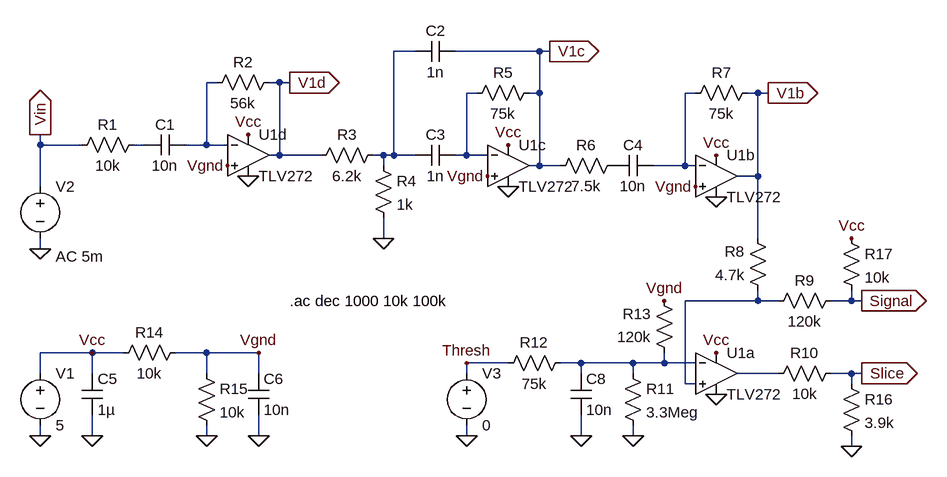
[diagram p0: schematic AnalogModel.asc]
AnalogModel.asc, the LTspice schematic file:
Version 4
SHEET 1 1284 680
WIRE 464 -208 432 -208
WIRE 656 -208 528 -208
WIRE 672 -208 656 -208
WIRE 160 -160 144 -160
WIRE 256 -160 240 -160
WIRE 272 -160 256 -160
WIRE 560 -144 544 -144
WIRE 656 -144 656 -208
WIRE 656 -144 640 -144
WIRE 896 -144 880 -144
WIRE 992 -144 976 -144
WIRE 1008 -144 992 -144
WIRE -112 -64 -112 -80
WIRE -48 -64 -112 -64
WIRE 48 -64 32 -64
WIRE 144 -64 144 -160
WIRE 144 -64 112 -64
WIRE 176 -64 144 -64
WIRE 256 -48 256 -160
WIRE 256 -48 240 -48
WIRE 320 -48 256 -48
WIRE 416 -48 400 -48
WIRE 432 -48 432 -208
WIRE 432 -48 416 -48
WIRE 464 -48 432 -48
WIRE 544 -48 544 -144
WIRE 544 -48 528 -48
WIRE 576 -48 544 -48
WIRE 416 -32 416 -48
WIRE 656 -32 656 -144
WIRE 656 -32 640 -32
WIRE 688 -32 656 -32
WIRE 880 -32 880 -144
WIRE 880 -32 832 -32
WIRE 896 -32 880 -32
WIRE 992 -16 992 -144
WIRE 992 -16 960 -16
WIRE -112 0 -112 -64
WIRE 416 80 416 48
WIRE 992 80 992 -16
WIRE -112 96 -112 80
WIRE 992 176 992 160
WIRE 992 176 880 176
WIRE 1024 176 992 176
WIRE 1136 176 1136 160
WIRE 1136 176 1104 176
WIRE 1152 176 1136 176
WIRE -32 256 -112 256
WIRE 16 256 -32 256
WIRE 144 256 96 256
WIRE 224 256 144 256
WIRE 608 272 544 272
WIRE 720 272 688 272
WIRE 800 272 720 272
WIRE 848 272 848 256
WIRE 848 272 800 272
WIRE 896 272 848 272
WIRE -112 288 -112 256
WIRE -32 288 -32 256
WIRE 144 288 144 256
WIRE 224 288 224 256
WIRE 544 288 544 272
WIRE 720 288 720 272
WIRE 800 288 800 272
WIRE 1024 288 960 288
WIRE 1136 288 1104 288
WIRE 1152 288 1136 288
WIRE 880 304 880 176
WIRE 896 304 880 304
WIRE 1136 304 1136 288
WIRE -112 384 -112 368
WIRE -32 384 -32 352
WIRE 144 384 144 368
WIRE 224 384 224 352
WIRE 544 384 544 368
WIRE 720 384 720 352
WIRE 800 384 800 368
WIRE 1136 400 1136 384
FLAG -112 384 0
FLAG -32 384 0
FLAG 144 384 0
FLAG 224 384 0
FLAG 544 384 0
FLAG 720 384 0
FLAG 800 384 0
FLAG 928 320 0
FLAG 928 16 0
FLAG 608 0 0
FLAG 208 -16 0
FLAG 1136 400 0
FLAG -112 96 0
FLAG -32 256 Vcc
FLAG 208 -80 Vcc
FLAG 608 -64 Vcc
FLAG 928 256 Vcc
FLAG 928 -48 Vcc
FLAG 1136 80 Vcc
FLAG 224 256 Vgnd
FLAG 176 -32 Vgnd
FLAG 576 -16 Vgnd
FLAG 896 0 Vgnd
FLAG 848 176 Vgnd
FLAG 544 272 Thresh
FLAG -112 -80 Vin
IOPIN -112 -80 Out
FLAG 272 -160 V1d
IOPIN 272 -160 Out
FLAG 672 -208 V1c
IOPIN 672 -208 Out
FLAG 1008 -144 V1b
IOPIN 1008 -144 Out
FLAG 1152 176 Signal
IOPIN 1152 176 Out
FLAG 1152 288 Slice
IOPIN 1152 288 Out
FLAG 416 80 0
SYMBOL voltage -112 272 R0
SYMATTR InstName V1
SYMATTR Value 5
SYMBOL voltage -112 -16 R0
WINDOW 123 24 124 Left 2
WINDOW 39 0 0 Left 0
SYMATTR InstName V2
SYMATTR Value ""
SYMATTR Value2 AC 5m
SYMBOL voltage 544 272 R0
SYMATTR InstName V3
SYMATTR Value 0
SYMBOL Misc\\TLV272 208 -48 R0
SYMATTR InstName U1d
SYMBOL Misc\\TLV272 608 -32 R0
SYMATTR InstName U1c
SYMBOL Misc\\TLV272 928 -16 R0
SYMATTR InstName U1b
SYMBOL Misc\\TLV272 928 288 R0
SYMATTR InstName U1a
SYMBOL res 48 -80 R90
WINDOW 0 0 56 VBottom 2
WINDOW 3 32 56 VTop 2
SYMATTR InstName R1
SYMATTR Value 10k
SYMBOL res 256 -176 R90
WINDOW 0 0 56 VBottom 2
WINDOW 3 32 56 VTop 2
SYMATTR InstName R2
SYMATTR Value 56k
SYMBOL res 416 -64 R90
WINDOW 0 0 56 VBottom 2
WINDOW 3 32 56 VTop 2
SYMATTR InstName R3
SYMATTR Value 6.2k
SYMBOL res 400 -48 R0
SYMATTR InstName R4
SYMATTR Value 1k
SYMBOL res 784 -48 R90
WINDOW 0 0 56 VBottom 2
WINDOW 3 32 56 VTop 2
SYMATTR InstName R6
SYMATTR Value 7.5k
SYMBOL res 992 -160 R90
WINDOW 0 0 56 VBottom 2
WINDOW 3 32 56 VTop 2
SYMATTR InstName R7
SYMATTR Value 75k
SYMBOL res 1008 176 R180
WINDOW 0 36 76 Left 2
WINDOW 3 36 40 Left 2
SYMATTR InstName R8
SYMATTR Value 4.7k
SYMBOL res 1008 192 R270
WINDOW 0 32 56 VTop 2
WINDOW 3 0 56 VBottom 2
SYMATTR InstName R9
SYMATTR Value 120k
SYMBOL res 1008 304 R270
WINDOW 0 32 56 VTop 2
WINDOW 3 0 56 VBottom 2
SYMATTR InstName R10
SYMATTR Value 10k
SYMBOL res 784 272 R0
SYMATTR InstName R11
SYMATTR Value 3.3Meg
SYMBOL res 704 256 R90
WINDOW 0 0 56 VBottom 2
WINDOW 3 32 56 VTop 2
SYMATTR InstName R12
SYMATTR Value 75k
SYMBOL res 864 272 R180
WINDOW 0 36 76 Left 2
WINDOW 3 36 40 Left 2
SYMATTR InstName R13
SYMATTR Value 120k
SYMBOL res 0 272 R270
WINDOW 0 32 56 VTop 2
WINDOW 3 0 56 VBottom 2
SYMATTR InstName R14
SYMATTR Value 10k
SYMBOL res 128 272 R0
SYMATTR InstName R15
SYMATTR Value 10k
SYMBOL res 1120 288 R0
SYMATTR InstName R16
SYMATTR Value 3.9k
SYMBOL res 1120 64 R0
SYMATTR InstName R17
SYMATTR Value 10k
SYMBOL cap 112 -80 R90
WINDOW 0 0 32 VBottom 2
WINDOW 3 32 32 VTop 2
SYMATTR InstName C1
SYMATTR Value 10n
SYMBOL cap 528 -224 R90
WINDOW 0 0 32 VBottom 2
WINDOW 3 32 32 VTop 2
SYMATTR InstName C2
SYMATTR Value 1n
SYMBOL cap 528 -64 R90
WINDOW 0 0 32 VBottom 2
WINDOW 3 32 32 VTop 2
SYMATTR InstName C3
SYMATTR Value 1n
SYMBOL cap 832 -48 R90
WINDOW 0 0 32 VBottom 2
WINDOW 3 32 32 VTop 2
SYMATTR InstName C4
SYMATTR Value 10n
SYMBOL cap -48 288 R0
SYMATTR InstName C5
SYMATTR Value 1µ
SYMBOL cap 208 288 R0
SYMATTR InstName C6
SYMATTR Value 10n
SYMBOL res 656 -160 R90
WINDOW 0 0 56 VBottom 2
WINDOW 3 32 56 VTop 2
SYMATTR InstName R5
SYMATTR Value 75k
SYMBOL cap 704 288 R0
SYMATTR InstName C8
SYMATTR Value 10n
TEXT 272 176 Left 2 !.ac dec 1000 10k 100k

The netlist it stands for:
* AnalogModel.asc
V1 Vcc 0 5
V2 Vin 0 AC 5m
V3 Thresh 0 0
* U1d: TLV272 (symbol Misc\TLV272 not available, pins judged from their places): In+=Vgnd In-=N002 V+=Vcc V-=0 OUT=V1d
* U1c: TLV272 (symbol Misc\TLV272 not available, pins judged from their places): In+=Vgnd In-=N003 V+=Vcc V-=0 OUT=V1c
* U1b: TLV272 (symbol Misc\TLV272 not available, pins judged from their places): In+=Vgnd In-=N004 V+=Vcc V-=0 OUT=V1b
* U1a: TLV272 (symbol Misc\TLV272 not available, pins judged from their places): In+=N006 In-=N007 V+=Vcc V-=0 OUT=N008
R1 N005 Vin 10k
R2 V1d N002 56k
R3 N001 V1d 6.2k
R4 N001 0 1k
R6 P001 V1c 7.5k
R7 V1b N004 75k
R8 N006 V1b 4.7k
R9 N006 Signal 120k
R10 N008 Slice 10k
R11 N007 0 3.3Meg
R12 N007 Thresh 75k
R13 N007 Vgnd 120k
R14 Vcc Vgnd 10k
R15 Vgnd 0 10k
R16 Slice 0 3.9k
R17 Vcc Signal 10k
C1 N002 N005 10n
C2 V1c N001 1n
C3 N003 N001 1n
C4 N004 P001 10n
C5 Vcc 0 1µ
C6 Vgnd 0 10n
R5 V1c N003 75k
C8 N007 0 10n
.ac dec 1000 10k 100k
.backanno
.end